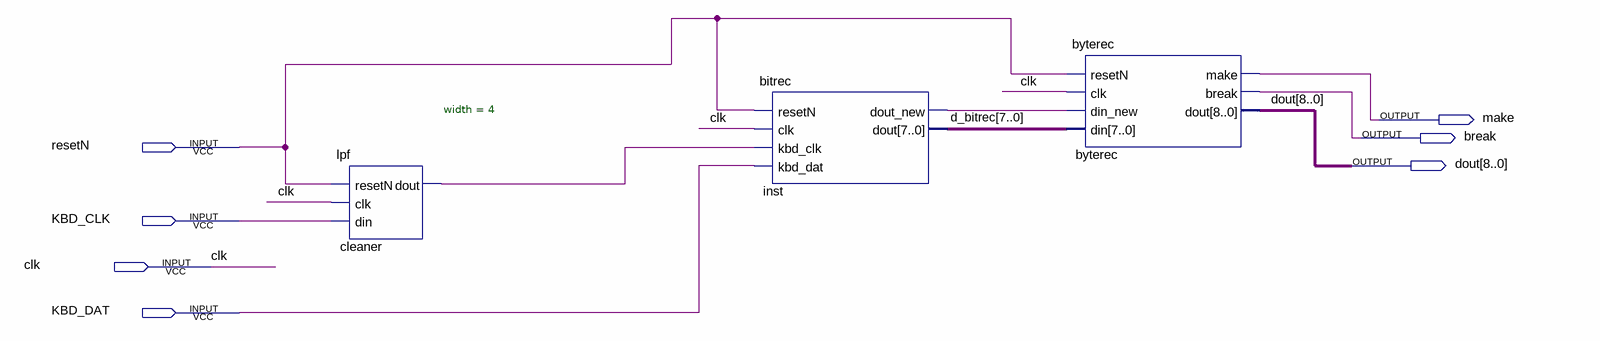
[diagram p0: schematic sheet]
// Quartus schematic Debug_Bitrec_partial.bdf as structural Verilog: 3 symbols, 7 pins
module Debug_Bitrec_partial (
  input  resetN,
  input  KBD_CLK,
  input  clk,
  input  KBD_DAT,
  output make,
  output \break ,
  output [8:0] dout
);

  wire cleaner_dout, inst_dout_new;
  wire [7:0] d_bitrec;

  lpf #(.width(4)) cleaner (.resetN(resetN), .clk(clk), .din(KBD_CLK), .dout(cleaner_dout));
  bitrec inst (
    .resetN(resetN), .clk(clk), .kbd_clk(cleaner_dout), .kbd_dat(KBD_DAT), .dout_new(inst_dout_new),
    .dout(d_bitrec));
  byterec byterec (
    .resetN(resetN), .clk(clk), .din_new(inst_dout_new), .din(d_bitrec), .make(make), .\break (\break ),
    .dout(dout));
endmodule
